# EAGLE schematic 8051 (EAGLE 6.5.0)
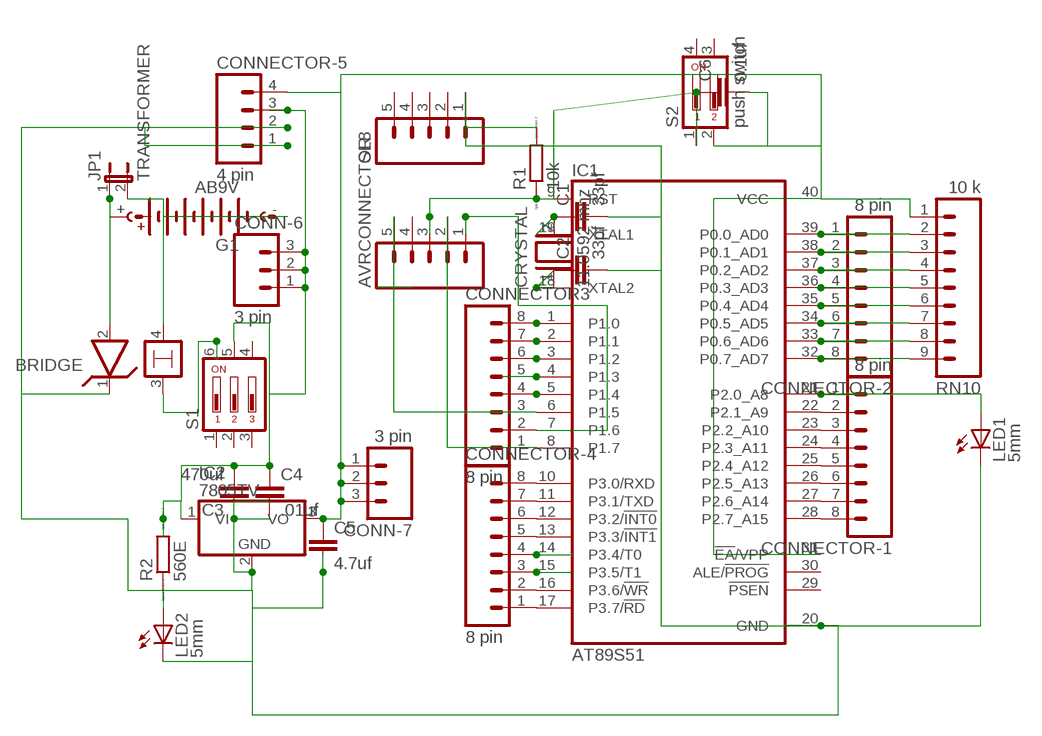
[diagram p0: schematic, sheet 1]

## Parts
AVRCONNECTOR  M05  [05P]
BRIDGE  LM399H  [TO39/4]
C1  33pf  C-EU025-024X044  [C025-024X044]
C2  33pf  C-EU025-024X044  [C025-024X044]
C3  470uf  C5/7.2  [C5B7.2]
C4  .01uf  C2,5-3  [C2.5-3]
C5  4.7uf  C2,5-3  [C2.5-3]
C6  0.1uf  C2,5-3  [C2.5-3]
CONN-6  3 pin  M03  [03P]
CONN-7  3 pin  M03  [03P]
CONNECTOR3  8 pin  M08  [08P]
CONNECTOR-1  8 pin  M08  [08P]
CONNECTOR-2  8 pin  M08  [08P]
CONNECTOR-4  8 pin  M08  [08P]
CONNECTOR-5  4 pin  M04  [04P]
CRYSTAL  11.0592 mhz  XTAL/S  [QS]
G1  AB9V  [AB9V]
IC1  AT89S51  AT89C51-12PC  [DIL40]
IC2  7805TV  [TO220V]
JP1  TRANSFORMER  JP1E  [JP1]
LED1  5mm  LED5MM  [LED5MM]
LED2  5mm  LED5MM  [LED5MM]
R1  10k  R0204/7  [0204/7]
R2  560E  R0204/7  [0204/7]
RN10  10 k  M09  [09P]
S1  DA03  [DA-03]
S2  push switch  DP02  [DP-02]
SL8  M05  [05P]

## Nets
N$1: C2.1 CRYSTAL.1 IC1.18(XTAL2)
N$2: C1.1 CRYSTAL.2 IC1.19(XTAL1)
N$4: C3.2 C4.1 CONN-6.1 CONN-6.2 CONN-6.3 CONNECTOR-5.3 IC2.1(VI) R2.2 S1.5
N$5: BRIDGE.2 G1.+ JP1.1
N$6: CONNECTOR-4.8 IC1.10(P3.0/RXD)
N$7: CONNECTOR-4.7 IC1.11(P3.1/TXD)
N$8: CONNECTOR-4.6 IC1.12(P3.2/!INT0)
N$9: CONNECTOR-4.5 IC1.13(P3.3/!INT1)
N$10: CONNECTOR-4.4 IC1.14(P3.4/T0)
N$11: CONNECTOR-4.3 IC1.15(P3.5/T1)
N$12: CONNECTOR-4.2 IC1.16(P3.6/!WR)
N$13: CONNECTOR-4.1 IC1.17(P3.7/!RD)
N$14: AVRCONNECTOR.3 C6.1 IC1.9(RST) R1.1 S2.1
N$15: AVRCONNECTOR.1 CONNECTOR3.2 IC1.7(P1.6)
N$16: BRIDGE.4 G1.- JP1.2
N$17: CONNECTOR3.4 IC1.5(P1.4)
N$18: CONNECTOR3.5 IC1.4(P1.3)
N$19: CONNECTOR3.6 IC1.3(P1.2)
N$20: CONNECTOR3.7 IC1.2(P1.1)
N$21: CONNECTOR3.8 IC1.1(P1.0)
N$22: CONNECTOR-2.1 IC1.39(P0.0_AD0) RN10.2
N$23: CONNECTOR-2.2 IC1.38(P0.1_AD1) RN10.3
N$24: CONNECTOR-2.3 IC1.37(P0.2_AD2) RN10.4
N$25: CONNECTOR-2.4 IC1.36(P0.3_AD3) RN10.5
N$26: CONNECTOR-2.5 IC1.35(P0.4_AD4) RN10.6
N$27: CONNECTOR-2.6 IC1.34(P0.5_AD5) RN10.7
N$28: CONNECTOR-2.7 IC1.33(P0.6_AD6) RN10.8
N$29: CONNECTOR-2.8 IC1.32(P0.7_AD7) RN10.9
N$30: CONNECTOR-1.1 IC1.21(P2.0_A8) LED1.A
N$31: CONNECTOR-1.2 IC1.22(P2.1_A9)
N$32: CONNECTOR-1.3 IC1.23(P2.2_A10)
N$33: CONNECTOR-1.4 IC1.24(P2.3_A11)
N$34: CONNECTOR-1.5 IC1.25(P2.4_A12)
N$35: CONNECTOR-1.6 IC1.26(P2.5_A13)
N$36: CONNECTOR-1.7 IC1.27(P2.6_A14)
N$37: CONNECTOR-1.8 IC1.28(P2.7_A15)
N$39: C5.1 C6.2 CONN-7.1 CONN-7.2 CONN-7.3 CONNECTOR-5.4 IC1.31(!EA!/VPP) IC1.40(VCC) IC2.3(VO) RN10.1 S2.2
N$41: BRIDGE.1 C1.2 C2.2 C3.1 C4.2 C5.2 CONNECTOR-5.1 CONNECTOR-5.2 IC1.20(GND) IC2.2(GND) LED1.K(C) LED2.K(C) R1.2 SL8.1
N$42: AVRCONNECTOR.5 CONNECTOR3.3 IC1.6(P1.5)
N$43: LED2.A R2.1
N$45: AVRCONNECTOR.2 CONNECTOR3.1 IC1.8(P1.7)
N$47: BRIDGE.3 S1.6
Unconnected: AVRCONNECTOR.4 IC1.29(!PSEN) IC1.30(ALE/!PROG) S1.1 S1.2 S1.3 S1.4 S2.3 S2.4 SL8.2 SL8.3 SL8.4 SL8.5

## Library data of the parts
AVRCONNECTOR SL8 = con-amp-quick:M05: AMP QUICK CONNECTOR; OC_FARNELL: unknown; OC_NEWARK: unknown
BRIDGE = linear:LM399H: Precision Z DIODE
C1 C2 = rcl:C-EU: CAPACITOR, European symbol
C3-C6 = capacitor-wima:C: CAPACITOR naming: grid - package width
CONN-6 CONN-7 = con-amp-quick:M03: AMP QUICK CONNECTOR; OC_FARNELL: unknown; OC_NEWARK: unknown
CONNECTOR3 CONNECTOR-1 CONNECTOR-2 CONNECTOR-4 = con-amp-quick:M08: AMP QUICK CONNECTOR; OC_FARNELL: unknown; OC_NEWARK: unknown
CONNECTOR-5 = con-amp-quick:M04: AMP QUICK CONNECTOR; OC_FARNELL: unknown; OC_NEWARK: unknown
CRYSTAL = special:XTAL/S: CRYSTAL
G1 = battery:AB9V: 9-V BATTERY CLIP
IC1 = atmel:AT89C51-*: 8-bit Microcontroller with 4K Bytes Flash Not Recommended for New Designs. Use AT89S51. Source: http://www.atmel.com/dyn/resources/prod_documents/doc0265.; OC_FARNELL: unknown; OC_NEWARK: unknown
IC2 = linear:78*: Positive VOLTAGE REGULATOR Source: http://cache.national.com/ds/LM/LM78L05.pdf http://www.fairchildsemi.com/ds/LM/LM7805.pdf
JP1 = jumper:JP1E: JUMPER
LED1 LED2 = led:LED: LED OSRAM: - CHIPLED LG R971, LG N971, LY N971, LG Q971, LY Q971, LO R971, LY R971 LH N974, LH R974 LS Q976, LO Q976, LY Q976 LO Q996 - Hyper CHIPLED LW Q18S LB Q993, LB Q99A, LB R99A - SideLED LS A670, LO A670, LY A670, LG A670, LP A670 LB A673, LV A673, LT A673, LW A673 LH A674 LY A675 LS A676, LA A676, LO A676, LY A676, LW A676 LS A679, LY A679, LG A679 - Hyper Micro SIDELED® LS Y876, LA Y876, LO Y876, LY Y876 LT Y87S - SmartLED LW L88C, LW L88S LB L89C, LB L89S, LG L890 LS L89K, LO L89K, LY L89K LS L896, LA L896, LO L896, LY L896 - TOPLED LS T670, LO T670, LY T670, LG T670, LP T670 LSG T670, LSP T670, LSY T670, LOP T670, LYG T670 LG T671, LOG T671, LSG T671 LB T673, LV T673, LT T673, LW T673 LH T674 LS T676, LA T676, LO T676, LY T676, LB T676, LH T676, LSB T676, LW T676 LB T67C, LV T67C, LT T67C, LS T67K, LO T67K, LY T67K, LW E67C LS E67B, LA E67B, LO E67B, LY E67B, LB E67C, LV E67C, LT E67C LW T67C LS T679, LY T679, LG T679 LS T770, LO T770, LY T770, LG T770, LP T770 LB T773, LV T773, LT T773, LW T773 LH T774 LS E675, LA E675, LY E675, LS T675 LS T776, LA T776, LO T776, LY T776, LB T776 LHGB T686 LT T68C, LB T68C - Hyper Mini TOPLED® LB M676 - Mini TOPLED Santana® LG M470 LS M47K, LO M47K, LY M47K Source: http://www.osram.convergy.de LUXEON: - LUMILED® LXK2-PW12-R00, LXK2-PW12-S00, LXK2-PW14-U00, LXK2-PW14-V00 LXK2-PM12-R00, LXK2-PM12-S00, LXK2-PM14-U00 LXK2-PE12-Q00, LXK2-PE12-R00, LXK2-PE12-S00, LXK2-PE14-T00, LXK2-PE14-U00 LXK2-PB12-K00, LXK2-PB12-L00, LXK2-PB12-M00, LXK2-PB14-N00, LXK2-PB14-P00, LXK2-PB14-Q00 LXK2-PR12-L00, LXK2-PR12-M00, LXK2-PR14-Q00, LXK2-PR14-R00 LXK2-PD12-Q00, LXK2-PD12-R00, LXK2-PD12-S00 LXK2-PH12-R00, LXK2-PH12-S00 LXK2-PL12-P00, LXK2-PL12-Q00, LXK2-PL12-R00 Source: www.luxeon.com KINGBRIGHT: KA-3528ASYC Source: www.kingbright.com
R1 R2 = eagle-ltspice:R: RESISTOR, European symbol; SPICEMODEL: NONE; SPICEPREFIX: R
RN10 = con-amp-quick:M09: AMP QUICK CONNECTOR; OC_FARNELL: unknown; OC_NEWARK: unknown
S1 = switch-dil:DA03: DIL/CODE SWITCH; MPN: MCDA03; OC_FARNELL: 1521999; OC_NEWARK: 74M2972
S2 = switch-dil:DP02: DIL/CODE SWITCH; MPN: MCDP02; OC_FARNELL: 1255233; OC_NEWARK: 26M1095